# EAGLE design SerialGLCD (EAGLE 6.1)
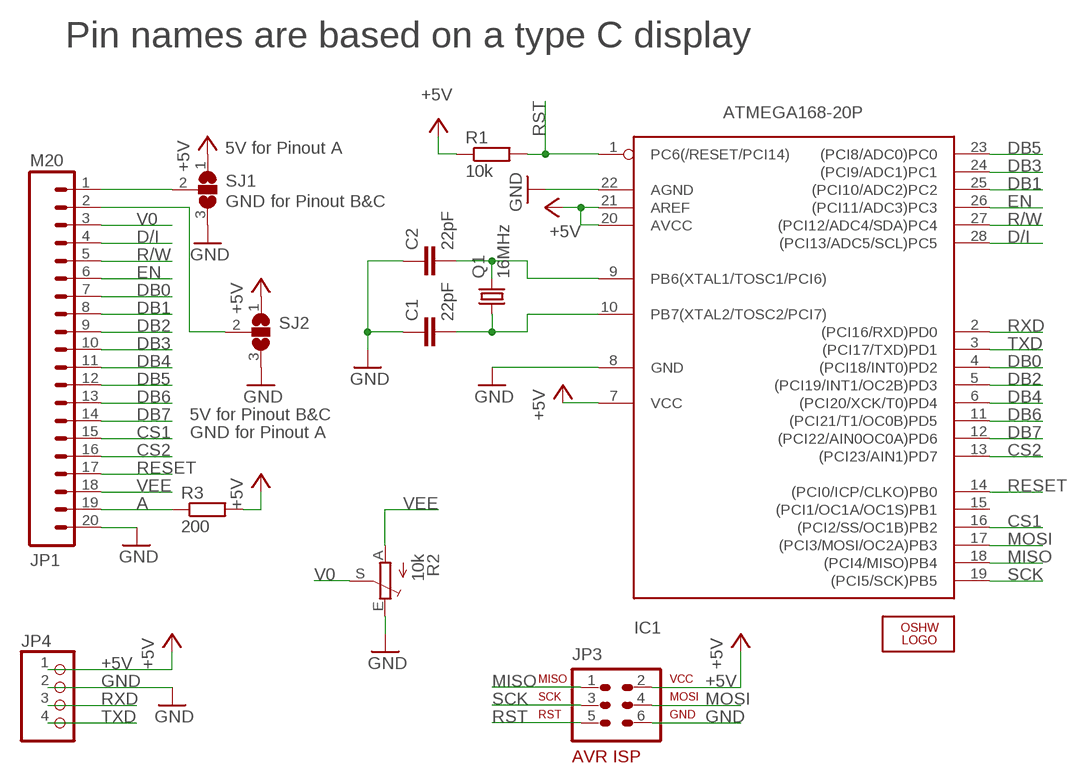
[diagram p0: schematic, sheet 1]

## Parts
C1  22pF  C-EU025-024X044  [C025-024X044]
C2  22pF  C-EU025-024X044  [C025-024X044]
IC1  ATMEGA168-20P  [DIL28-3]
JP1  M20  [1X20]
JP3  AVR-ISP-6VERT  [AVR-ISP-6]
JP4  PINHD-1X4/90  [1X04/90]
LOGO1  OSHW_LOGO_FILLX0100-NT  [OSHW_FILLX100_NOTEXT]
Q1  16MHz  CRYSTALHC49U-V  [HC49U-V]
R1  10k  R-EU_0207/10  [0207/10]
R2  10k  TRIM_EU-B25P  [B25P]
R3  200  R-EU_0207/10  [0207/10]
SJ1  SJ2W  [SJ_2]
SJ2  SJ2W  [SJ_2]

## Nets
+5V: IC1.7(VCC) IC1.20(AVCC) IC1.21(AREF) JP3.2 JP4.1 R1.1 R3.2 SJ1.1 SJ2.1
A: JP1.19 R3.1
CS1: IC1.16((PCI2/SS/OC1B)PB2) JP1.15
CS2: IC1.13((PCI23/AIN1)PD7) JP1.16
D/I: IC1.28((PCI13/ADC5/SCL)PC5) JP1.4
DB0: IC1.4((PCI18/INT0)PD2) JP1.7
DB1: IC1.25((PCI10/ADC2)PC2) JP1.8
DB2: IC1.5((PCI19/INT1/OC2B)PD3) JP1.9
DB3: IC1.24((PCI9/ADC1)PC1) JP1.10
DB4: IC1.6((PCI20/XCK/T0)PD4) JP1.11
DB5: IC1.23((PCI8/ADC0)PC0) JP1.12
DB6: IC1.11((PCI21/T1/OC0B)PD5) JP1.13
DB7: IC1.12((PCI22/AIN0OC0A)PD6) JP1.14
EN: IC1.26((PCI11/ADC3)PC3) JP1.6
GND: C1.1 C2.1 IC1.8(GND) IC1.22(AGND) JP1.20 JP3.6 JP4.2 R2.E SJ1.3 SJ2.3
MISO: IC1.18((PCI4/MISO)PB4) JP3.1
MOSI: IC1.17((PCI3/MOSI/OC2A)PB3) JP3.4
N$1: JP1.1 SJ1.2
N$2: JP1.2 SJ2.2
N$25: C2.2 IC1.9(PB6(XTAL1/TOSC1/PCI6)) Q1.2
N$26: C1.2 IC1.10(PB7(XTAL2/TOSC2/PCI7)) Q1.1
R/W: IC1.27((PCI12/ADC4/SDA)PC4) JP1.5
RESET: IC1.14((PCI0/ICP/CLKO)PB0) JP1.17
RST: IC1.1(PC6(/RESET/PCI14)) JP3.5 R1.2
RXD: IC1.2((PCI16/RXD)PD0) JP4.3
SCK: IC1.19((PCI5/SCK)PB5) JP3.3
TXD: IC1.3((PCI17/TXD)PD1) JP4.4
V0: JP1.3 R2.S
VEE: JP1.18 R2.A
Unconnected: IC1.15((PCI1/OC1A/OC1S)PB1)

## Notes on the sheet
- Pin names are based on a type C display
- 5V for Pinout A
- GND for Pinout B&C
- 5V for Pinout B&C
- GND for Pinout A

## Library data of the parts
C1 C2 = rcl:C-EU: CAPACITOR, European symbol
IC1 = adafruit:ATMEGA168*P: MICROCONTROLLER 16 kBytes FLASH 1 kBytes SRAM 512 Bytes EEPROM USART 8-channel 10 bit ADC
JP1 = SparkFun:M20: This is just like the LOCK variant in that the holes are staggared by 5 mil, but except for the last two holes. They are not altered from the "standard" footprint layout. This is used for a special purpose on the layout of our Graphic LCD Backpack. Make sure you want to use this device before selecting it for you project!
JP3 = avr-7:AVR-ISP-6: AVR ISP-6 Serial Programming Header
JP4 = pinhead:PINHD-1X4: PIN HEADER
LOGO1 = OSHW:OSHW_LOGO_FILL
Q1 = crystal:CRYSTAL: CRYSTAL; OC_FARNELL: 1666969; OC_NEWARK: unknown
R1 R3 = rcl:R-EU_: RESISTOR, European symbol
R2 = pot:TRIM_EU-: POTENTIOMETER
SJ1 SJ2 = jumper:SJ2W: SMD solder JUMPER

## Board
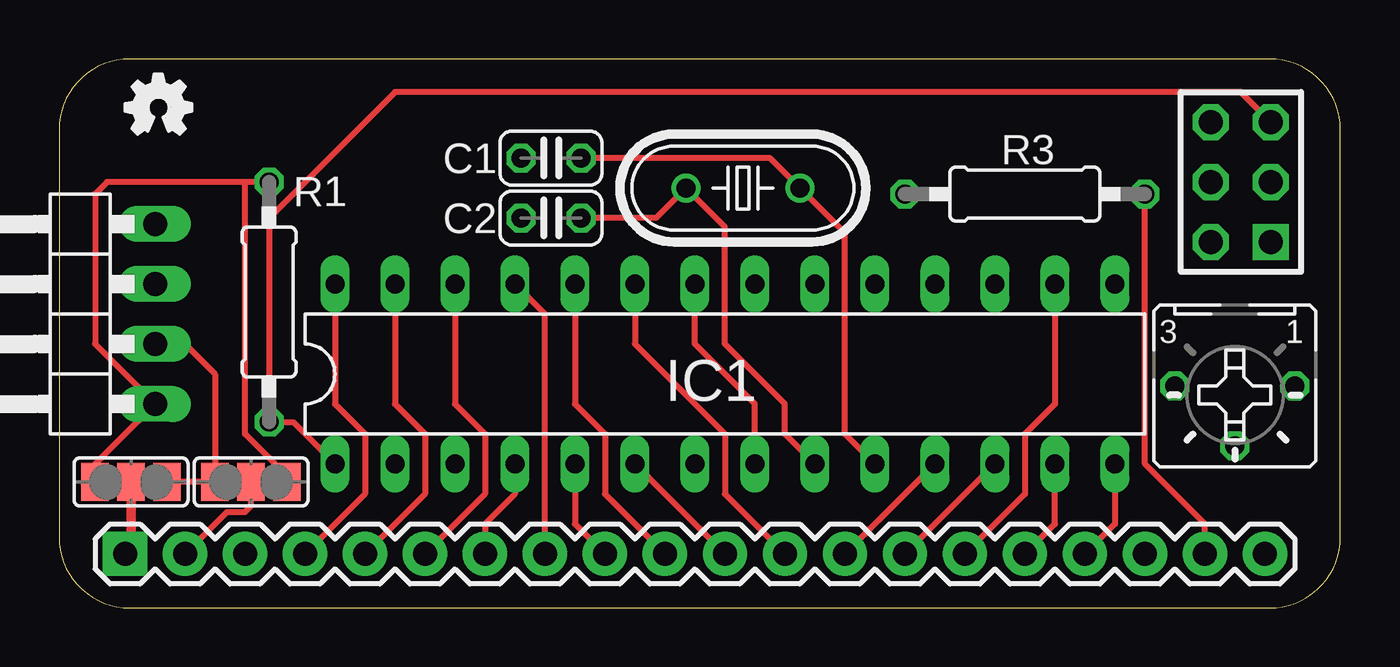
[diagram p1: board, top side]
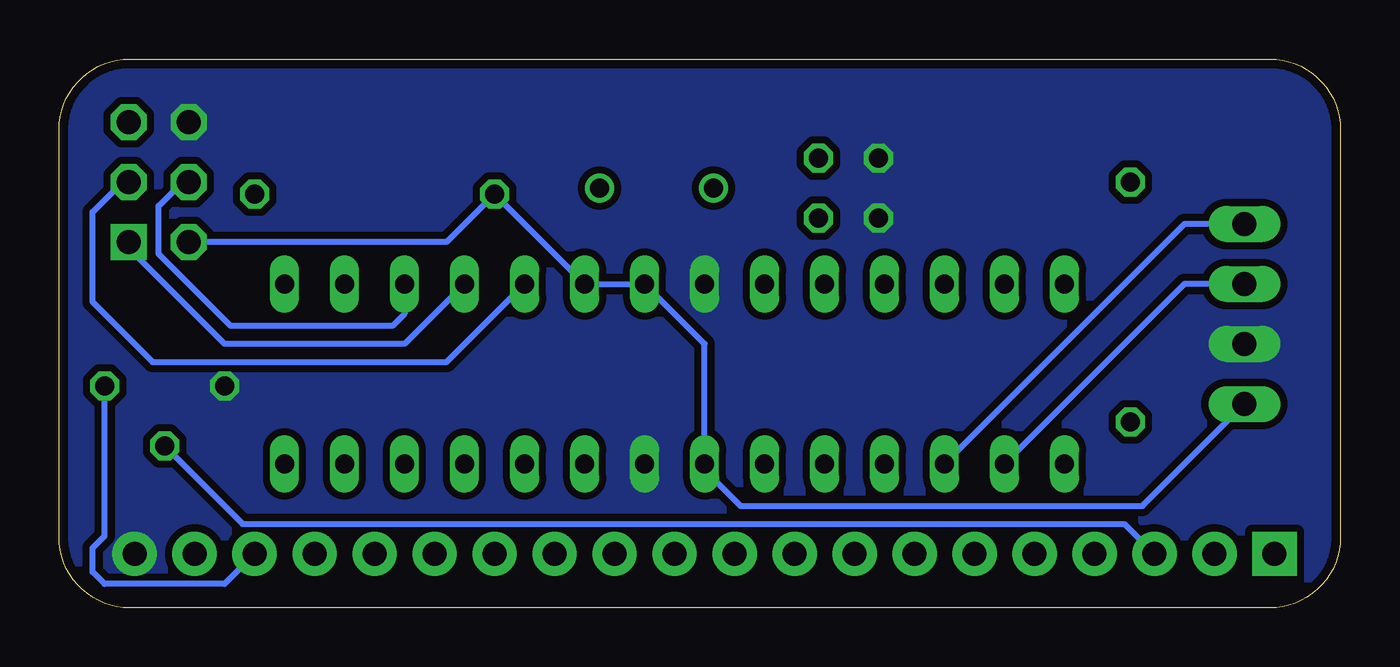
[diagram p2: board, bottom side, seen from below]

Size 54.25 x 23.25 mm. Coordinates in mm from the lower left corner, seen from the top.
Outline: 54.25,3 54.25,20.25 arc90 51.25,23.25 3,23.25 arc90 0,20.25 0,3 arc90 3,0 51.25,0 arc90 54.25,3
Copper layers (1*16): Top 0.0356mm / dielectric 1.5011mm / Bottom 0.0356mm
Design rules: minimum track width 6mil, minimum drill 13mil, track to track 6mil, track to pad 6mil, pad to pad 6mil, via to via 6mil, smd to smd 6mil, copper to edge 15mil, drill to drill 6mil, minimum pad ring 7mil, minimum via ring 7mil, stop-mask expansion 4mil, vias tented up to drill 0mil, thermal gap 10mil

### Footprints (pad centres in the part's own frame; a part is rotated, then mirrored left to right if it is on the bottom)
C025-024X044 = drill 0.813 octagon: 1 -1.27,0; 2 1.27,0
DIL28-3 = drill 0.813 long: 1 -16.51,-3.81; 2 -13.97,-3.81; 3 -11.43,-3.81; 4 -8.89,-3.81; 5 -6.35,-3.81; 6 -3.81,-3.81; 7 -1.27,-3.81; 8 1.27,-3.81; 9 3.81,-3.81; 10 6.35,-3.81; 11 8.89,-3.81; 12 11.43,-3.81; 13 13.97,-3.81; 14 16.51,-3.81; 15 16.51,3.81; 16 13.97,3.81; 17 11.43,3.81; 18 8.89,3.81; 19 6.35,3.81; 20 3.81,3.81; 21 1.27,3.81; 22 -1.27,3.81; 23 -3.81,3.81; 24 -6.35,3.81; 25 -8.89,3.81; 26 -11.43,3.81; 27 -13.97,3.81; 28 -16.51,3.81
1X20 = drill 1.016 pad 1.88 square: 1 0,0 | drill 1.016 pad 1.88: 2 2.54,0; 3 5.08,0; 4 7.62,0; 5 10.16,0; 6 12.7,0; 7 15.24,0; 8 17.78,0; 9 20.32,0; 10 22.86,0; 11 25.4,0; 12 27.94,0; 13 30.48,0; 14 33.02,0; 15 35.56,0; 16 38.1,0; 17 40.64,0; 18 43.18,0; 19 45.72,0; 20 48.26,0
AVR-ISP-6 = drill 1.016 square: 1 -2.54,-1.27 | drill 1.016 octagon: 2 -2.54,1.27; 3 0,-1.27; 4 0,1.27; 5 2.54,-1.27; 6 2.54,1.27
1X04/90 = drill 1.016 long: 1 -3.81,-3.81; 2 -1.27,-3.81; 3 1.27,-3.81; 4 3.81,-3.81
HC49U-V = drill 0.813: 1 -2.413,0; 2 2.413,0
0207/10 = drill 0.813 octagon: 1 -5.08,0; 2 5.08,0
B25P = drill 0.813 octagon: A -2.54,0; E 2.54,0; S 0,2.54
SJ_2 = smd 1.168 x 1.6: 1 -1.524,0; 2 0,0; 3 1.524,0

### Placement (x,y rotation side)
C1  20.83,19.05 0 top
C2  20.83,16.51 0 top
IC1  28.19,9.91 0 top
JP1  2.79,2.29 0 top
JP3  50.04,18.03 90 top
JP4  0.25,12.45 90 top
LOGO1  2.79,20.07 0 top
Q1  28.96,17.78 180 top
R1  8.89,12.95 270 top
R2  49.78,9.4 180 top
R3  40.89,17.53 180 top
SJ1  3.05,5.33 0 top
SJ2  8.13,5.33 180 top

### Tracks (layer width: path | path; a pad name or v marks a point on that pad's centre or on a via)
+5V
  Top 0.254: SJ1.1 1.52,6.1 JP4.1 1.52,11.18 1.52,17.53 2.03,18.03 7.87,18.03 | SJ2.1 9.14,5.33 9.14,6.1 7.87,7.37 7.87,18.03 | R1.1 7.87,18.03
  Bottom 0.254: JP4.1 8.38,4.32 25.4,4.32 26.92,5.84 IC1.7 26.92,11.18 IC1.21 IC1.20 R3.2 37.85,15.49 JP3.2
A
  Top 0.254: JP1.19 48.51,3.56 45.97,6.1 R3.1
CS1
  Top 0.254: IC1.16 42.16,8.64 40.89,7.37 40.89,4.83 JP1.15
CS2
  Top 0.254: JP1.16 42.16,3.56 IC1.13
D/I
  Top 0.254: IC1.28 11.68,8.64 12.95,7.37 12.95,4.83 JP1.4
DB0
  Top 0.254: IC1.4 19.3,4.83 18.03,3.56 JP1.7
DB1
  Top 0.254: JP1.8 20.57,12.45 IC1.25
DB2
  Top 0.254: IC1.5 21.84,3.56 JP1.9
DB3
  Top 0.254: IC1.24 21.84,8.64 23.11,7.37 23.11,4.83 JP1.10
DB4
  Top 0.254: IC1.6 JP1.11
DB5
  Top 0.254: IC1.23 24.38,11.18 28.19,7.37 28.19,4.83 JP1.12
DB6
  Top 0.254: IC1.11 JP1.13
DB7
  Top 0.254: IC1.12 JP1.14
EN
  Top 0.254: IC1.26 16.76,8.64 18.03,7.37 18.03,4.83 JP1.6
GND
  Top 0.254: SJ2.3 SJ1.3 | SJ2.3 6.6,4.83 | IC1.8 29.46,8.64 26.92,11.18 IC1.22 | JP4.2 5.33,11.18 6.6,9.91 SJ2.3
  pour Bottom (isolate 0.305, no thermals): -3.56,-4.06 -9.91,34.04 66.29,34.04 66.29,-5.33
MISO
  Bottom 0.254: IC1.18 39.62,11.18 47.24,11.18 51.31,15.24 JP3.1
MOSI
  Bottom 0.254: IC1.17 39.62,12.45 40.13,11.94 46.99,11.94 50.04,14.99 50.04,17.02 49.02,18.03 JP3.4
N$1
  Top 0.406: JP1.1 3.05,2.29 SJ1.2
N$2
  Top 0.254: JP1.2 7.11,4.06 7.87,4.06 8.13,4.32 SJ2.2
N$25
  Top 0.254: IC1.9 30.73,7.37 30.73,8.64 28.19,11.18 28.19,16.13 Q1.2 25.27,16.51 C2.2
N$26
  Top 0.254: IC1.10 33.27,7.37 33.27,15.88 Q1.1 30.1,19.05 C1.2
R/W
  Top 0.254: IC1.27 14.22,8.64 15.49,7.37 15.49,4.83 JP1.5
RESET
  Top 0.254: IC1.14 44.7,3.56 JP1.17
RST
  Top 0.254: IC1.1 9.91,7.87 R1.2 8.89,16.51 14.22,21.84 50.04,21.84 JP3.5
RXD
  Bottom 0.254: JP4.3 6.6,13.72 IC1.2
SCK
  Bottom 0.254: JP3.3 51.56,18.03 52.83,16.76 52.83,12.95 50.29,10.41 37.85,10.41 IC1.19
TXD
  Bottom 0.254: JP4.4 6.6,16.26 IC1.3
V0
  Bottom 0.254: JP1.3 9.14,3.56 46.48,3.56 R2.S
VEE
  Bottom 0.254: JP1.18 47.24,1.02 52.32,1.02 52.83,1.52 52.83,2.54 52.32,3.05 R2.A

### Text on the board
Measures: mm | mm
tDocu: TKJ Electronics | Serial backpack V1.0 | TX | RX | GND | 1 | 5V | 20
bDocu: 1 | 20